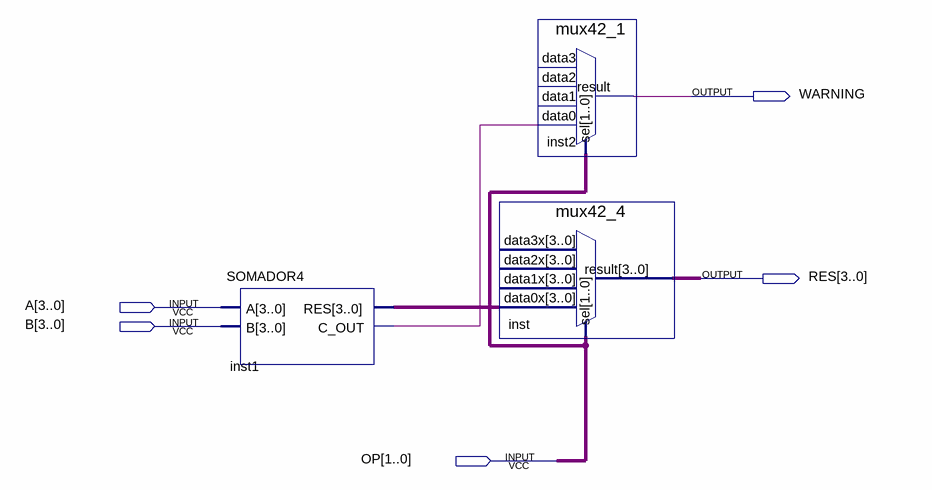
[diagram p0: schematic sheet]
// Quartus schematic ULA.bdf as structural Verilog: 3 symbols, 5 pins
module ULA (
  input  [3:0] A,
  input  [3:0] B,
  input  [1:0] OP,
  output WARNING,
  output [3:0] RES
);

  wire inst1_c_out;
  wire [3:0] inst1_res;

  SOMADOR4 inst1 (.A(A), .B(B), .RES(inst1_res), .C_OUT(inst1_c_out));
  mux42_1 inst2 (.data0(inst1_c_out), .sel(OP), .result(WARNING));  // open: data3, data2, data1
  mux42_4 inst (.data0x(inst1_res), .sel(OP), .result(RES));  // open: data3x, data2x, data1x
endmodule
